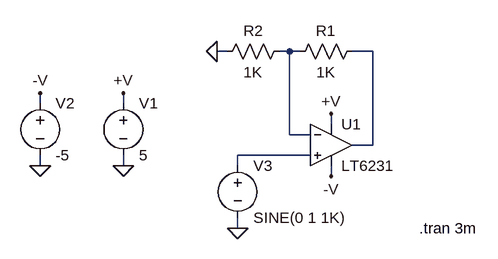
[diagram p0: schematic LT6231.asc]
LT6231.asc, the LTspice schematic file:
Version 4
SHEET 1 896 680
WIRE -80 80 -96 80
WIRE 16 80 0 80
WIRE 32 80 16 80
WIRE 144 80 112 80
WIRE -368 160 -368 144
WIRE -240 160 -240 144
WIRE 80 192 80 176
WIRE 16 208 16 80
WIRE 48 208 16 208
WIRE 144 224 144 80
WIRE 144 224 112 224
WIRE 48 240 -64 240
WIRE -368 256 -368 240
WIRE -240 256 -240 240
WIRE -64 256 -64 240
WIRE 80 272 80 256
WIRE -64 352 -64 336
FLAG -240 256 0
FLAG 80 176 +V
FLAG -240 144 +V
FLAG 80 272 -V
FLAG -368 256 0
FLAG -368 144 -V
FLAG -96 80 0
FLAG -64 352 0
SYMBOL voltage -240 144 R0
SYMATTR InstName V1
SYMATTR Value 5
SYMBOL voltage -368 144 R0
SYMATTR InstName V2
SYMATTR Value -5
SYMBOL res 128 64 R90
WINDOW 0 0 56 VBottom 2
WINDOW 3 32 56 VTop 2
SYMATTR InstName R1
SYMATTR Value 1K
SYMBOL res 16 64 R90
WINDOW 0 0 56 VBottom 2
WINDOW 3 32 56 VTop 2
SYMATTR InstName R2
SYMATTR Value 1K
SYMBOL voltage -64 240 R0
SYMATTR InstName V3
SYMATTR Value SINE(0 1 1K)
SYMBOL opamps\\LT6231 80 224 R0
SYMATTR InstName U1
TEXT 216 352 Left 2 !.tran 3m

The netlist it stands for:
* LT6231.asc
V1 +V 0 5
V2 -V 0 -5
R1 N002 N001 1K
R2 N001 0 1K
V3 N003 0 SINE(0 1 1K)
XU1 N003 N001 N002 +V -V LT6231  ; pins In+ In- OUT V+ V-
.tran 3m
.lib LTC2.lib
.backanno
.end